# EAGLE design ESPixelGECE (EAGLE 7.4.0)
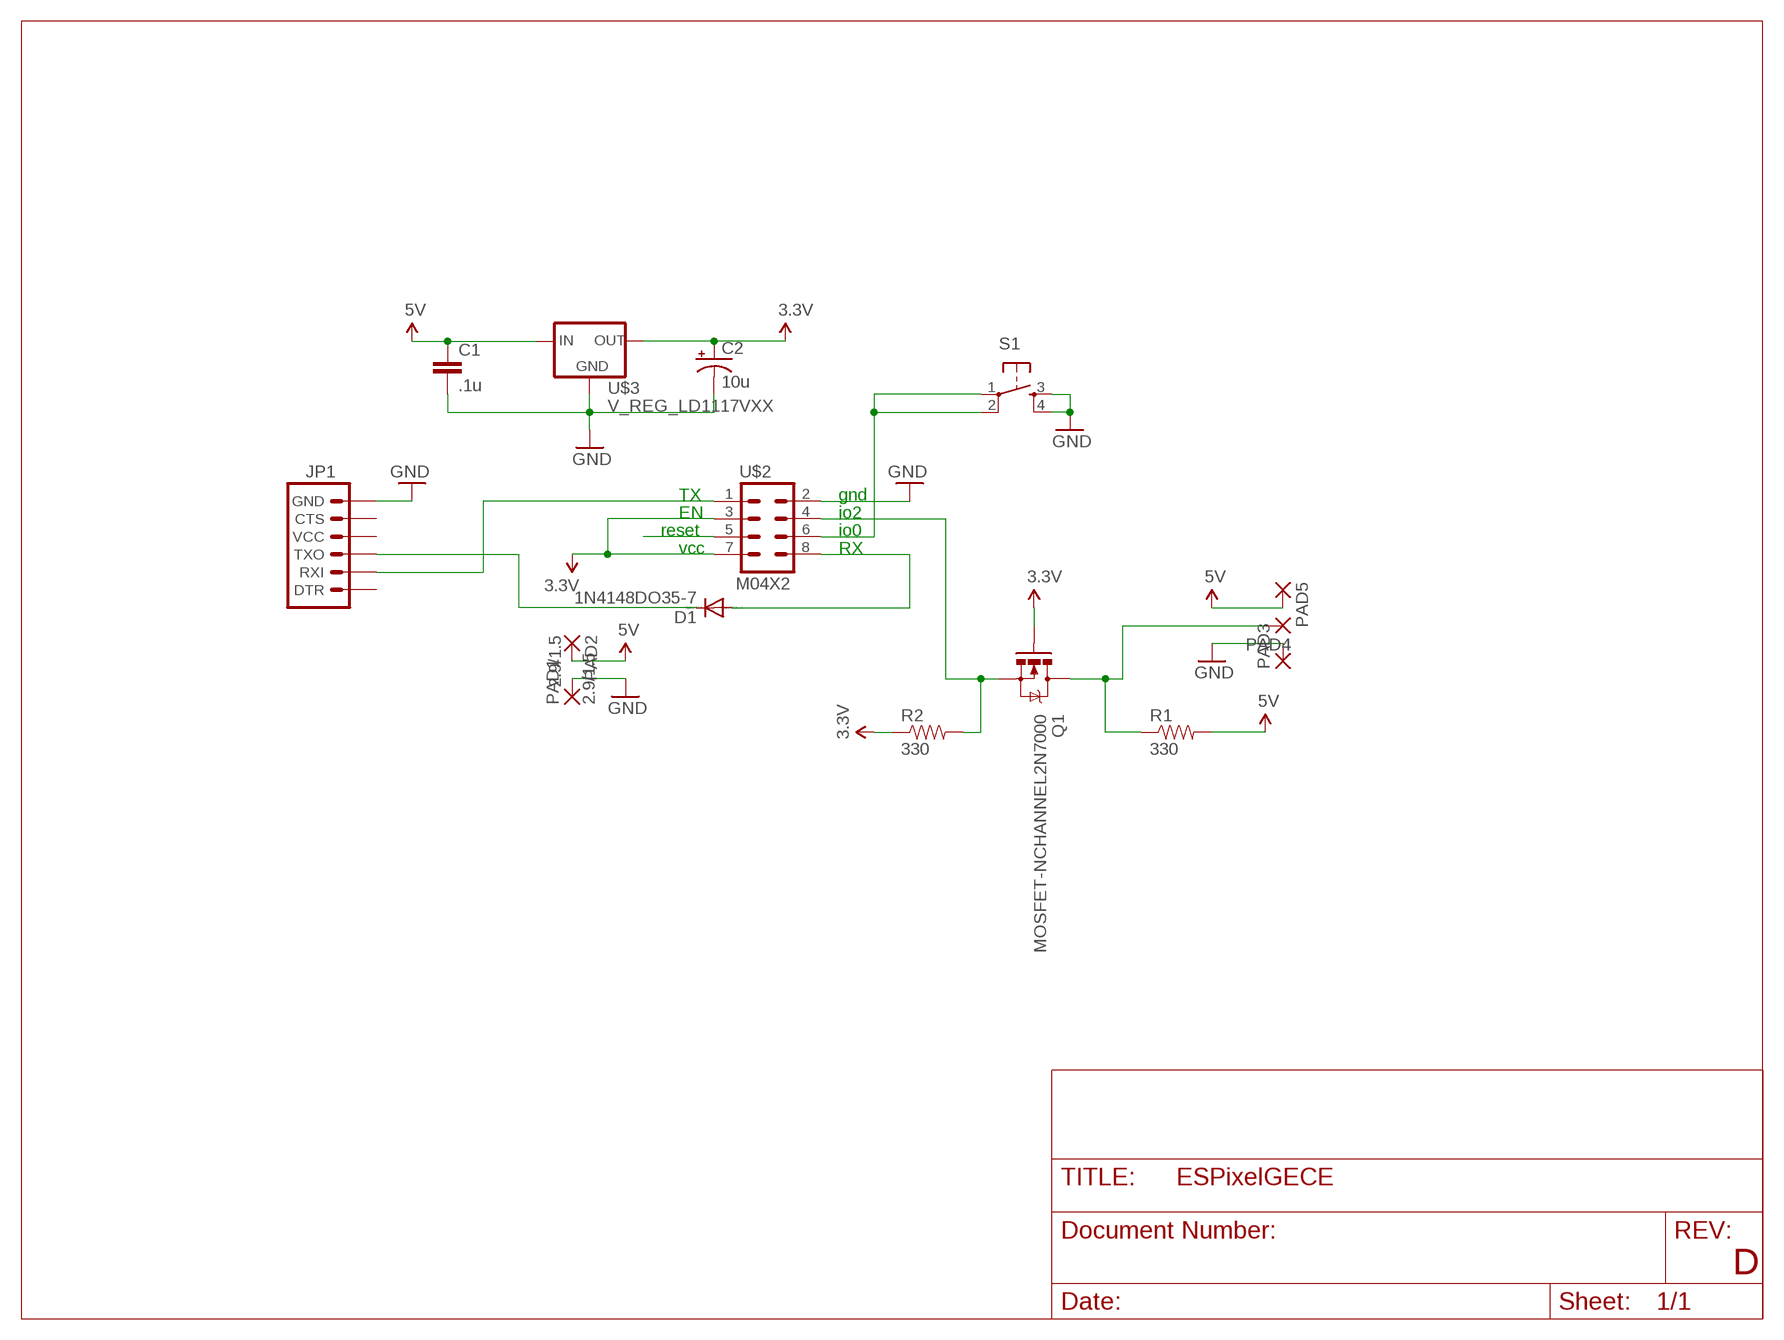
[diagram p0: schematic, sheet 1]

## Parts
C1  .1u  CAPEZ  [CAP-PTH-SMALLEZ]
C2  10u  CAP_POLPTH2  [CPOL-RADIAL-10UF-25V]
D1  1N4148DO35-7  [DO35-7]
JP1  ARDUINO_SERIAL_PROGRAMLOCK  [1X06_LOCK]
PAD1  2.9/1.5  [2.9/1.5]
PAD2  2.9/1.5  [2.9/1.5]
PAD3  2,15/1,0  [2,15/1,0]
PAD4  2,15/1,0  [2,15/1,0]
PAD5  2,15/1,0  [2,15/1,0]
Q1  MOSFET-NCHANNEL2N7000  [TO-92]
R1  330  RESISTOREZ  [AXIAL-0.3EZ]
R2  330  RESISTOREZ  [AXIAL-0.3EZ]
S1  TAC_SWITCHPTH  [TACTILE-PTH]
U$2  M04X2  [2X4]
U$3  V_REG_LD1117VXX  [78XXL]

## Nets
3.3V [PWR]: C2.1(+) Q1.2(G) R2.P$1 U$2.3 U$2.7 U$3.GND(OUT)
5V [PWR]: C1.1 PAD2.1(P) PAD5.1(P) R1.P$2 U$3.OUT(IN)
GND: C1.2 C2.2(-) JP1.6(GND) PAD1.1(P) PAD3.1(P) S1.3 S1.4 U$2.2 U$3.IN(GND)
N$1: JP1.2(RXI) U$2.1
N$2: D1.A U$2.8
N$3: U$2.5
N$4: PAD4.1(P) Q1.3(D) R1.P$1
N$5: S1.1 S1.2 U$2.6
N$6: Q1.1(S) R2.P$2 U$2.4
N$8: D1.C JP1.3(TXO)
Unconnected: JP1.1(DTR) JP1.4(VCC) JP1.5(CTS)

## Notes on the sheet
- TX | gnd
- EN | io2
- reset | io0
- vcc | RX
- D

## Library data of the parts
C1 = SparkFun-Capacitors:CAP: Capacitor Standard 0603 ceramic capacitor, and 0.1" leaded capacitor.
C2 = SparkFun-Capacitors:CAP_POL: Capacitor Polarized These are standard SMD and PTH capacitors. Normally 10uF, 47uF, and 100uF in electrolytic and tantalum varieties. Always verify the external diameter of the through hole cap, it varies with capacity, voltage, and manufacturer. The EIA devices should be standard.
D1 = diode:1N4148: DIODE high speed (Philips)
JP1 = SparkFun-Connectors:ARDUINO_SERIAL_PROGRAM: FTDI connector footprints
PAD1 PAD2 = wirepad:2.9/1.5
PAD3-PAD5 = wirepad:2,15/1,0: THROUGH-HOLE PAD
Q1 = SparkFun-DiscreteSemi:MOSFET-NCHANNEL: Common NMOSFET Parts MFG P/N Store ID Prod ID FDD8780 TRANS-09984 SI7820DN TRANS-11055 FDS6630A IC-08089 2N7002PW TRANS-11151 FQP30N06L COM-10213 TRANS-10060 BSS123LT1G TRANS-08345 BSS138 TRANS-00830 BS170 2N7000
R1 R2 = SparkFun-Resistors:RESISTOR: Resistor Basic schematic elements and footprints for 0603, 1206, and PTH resistors.
S1 = SparkFun-Retired:TAC_SWITCH: Momentary Switch Button commonly used for reset or general input. Spark Fun Electronics SKU : COM-00097 SMT- SWCH-08247
U$2 = SparkFun-Connectors:M04X2: .1" header, two rows of four.
U$3 = SparkFun-PowerIC:V_REG_LD1117VXX: LD1117VXX voltage regulator. We carry the 3.3V version (COM-00526) in TO-220 package.

## Net classes
0 default: width 0.305 mm
1 PWR: width 0.508 mm

## Board
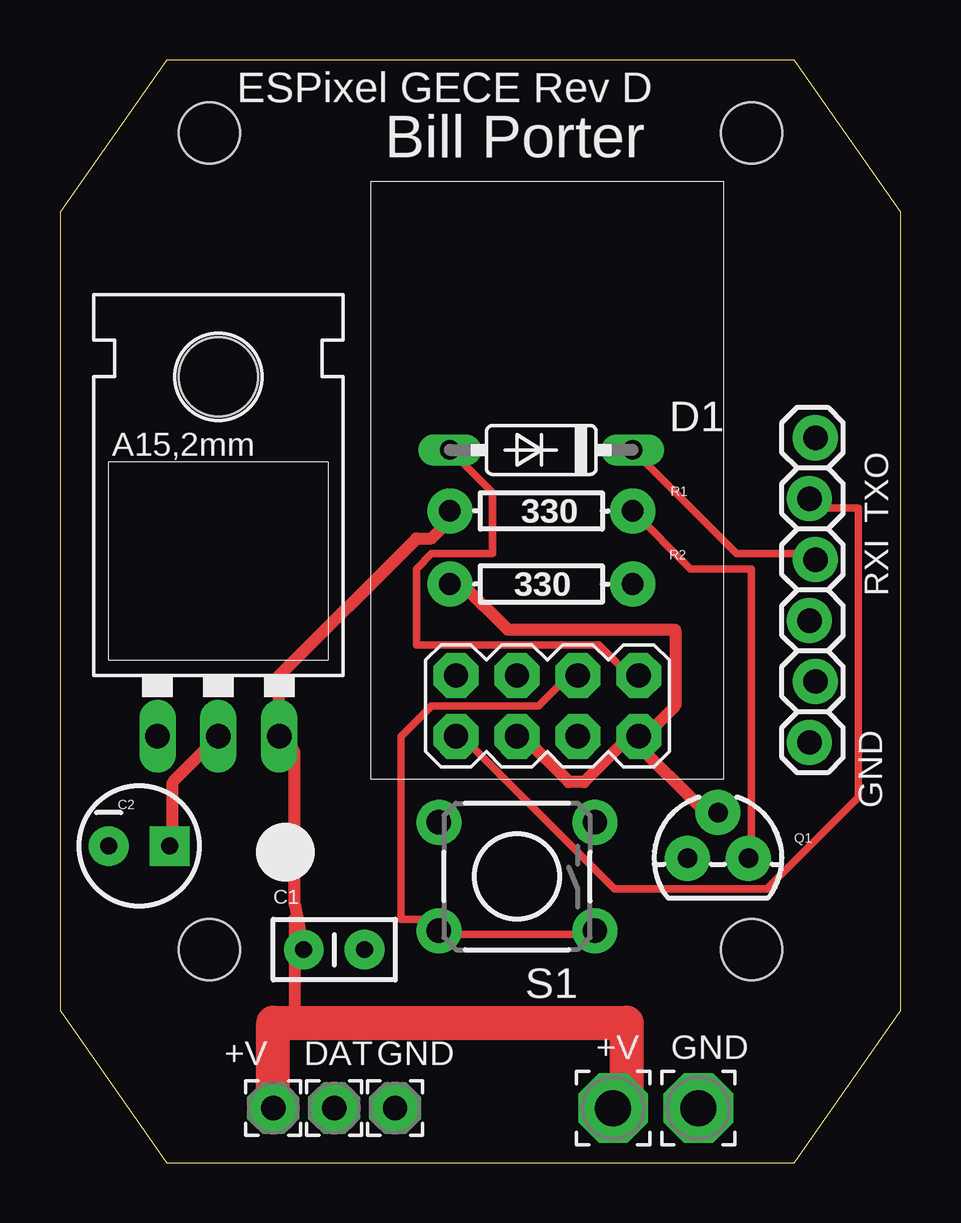
[diagram p1: board, top side]
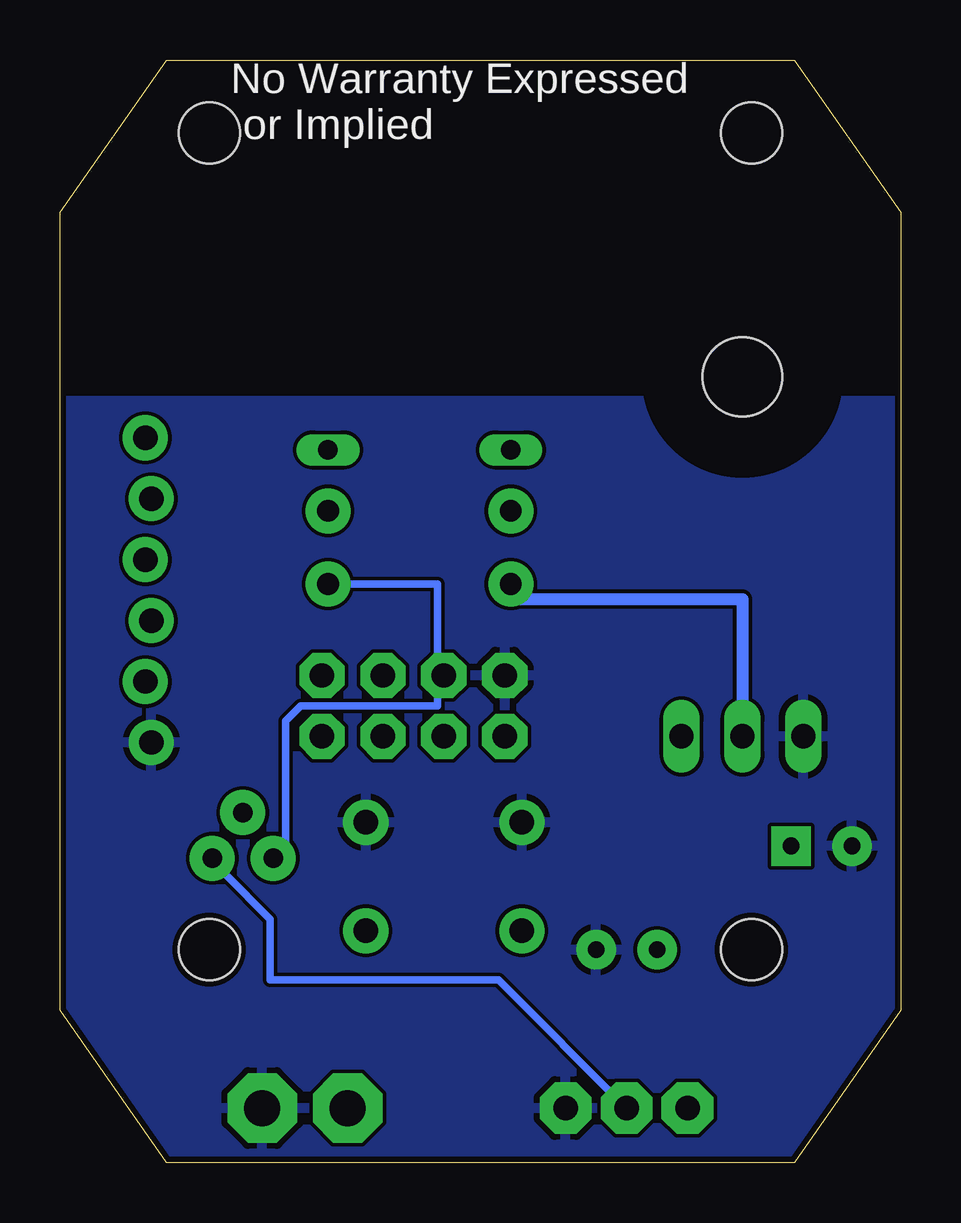
[diagram p2: board, bottom side, seen from below]

Size 35.05 x 45.97 mm. Coordinates in mm from the lower left corner, seen from the top.
Outline: 30.61,0 35.05,6.35 35.05,39.62 30.61,45.97 4.45,45.97 0,39.62 0,6.35 4.45,0 30.61,0
Copper layers (1*16): Top 0.035mm / dielectric 1.5mm / Bottom 0.035mm
Design rules "SeeedStudio_2layer_DRU_no_angle_20140221": minimum track width 6mil, minimum drill 12mil, track to track 6mil, track to pad 6mil, pad to pad 6mil, via to via 6mil, smd to smd 0mil, copper to edge 10mil, drill to drill 10mil, minimum pad ring 10mil, minimum via ring 6mil, stop-mask expansion 2mil, vias tented up to drill 100mil, thermal gap 10mil
Holes 2.54 mm at 6.22,42.93 28.83,42.93 6.22,8.89 28.83,8.89

### Footprints (pad centres in the part's own frame; a part is rotated, then mirrored left to right if it is on the bottom)
CAP-PTH-SMALLEZ = drill 0.7 pad 1.651: 1 0,0; 2 2.54,0
CPOL-RADIAL-10UF-25V = drill 0.7 pad 1.651 square: 1 1.27,0 | drill 0.7 pad 1.651: 2 -1.27,0
DO35-7 = drill 0.813 long: A 3.81,0; C -3.81,0
1X06_LOCK = drill 1.016 pad 1.88: 1 0,0; 2 2.54,-0.254; 3 5.08,0; 4 7.62,-0.254; 5 10.16,0; 6 12.7,-0.254
2.9/1.5 = drill 1.5 pad 2.9 octagon: 1 0.2,0
2,15/1,0 = drill 1.016 pad 2.159 octagon: 1 0,0
TO-92 = drill 0.813 pad 1.88: 1 -1.27,0; 2 0,1.905; 3 1.27,0
AXIAL-0.3EZ = drill 0.9 pad 1.88: P$1 -3.81,0; P$2 3.81,0
TACTILE-PTH = drill 1.016 pad 1.88: 1 -3.251,2.261; 2 3.251,2.261; 3 -3.251,-2.261; 4 3.251,-2.261
2X4 = drill 1.016 pad 1.88 octagon: 1 -3.81,-1.27; 2 -3.81,1.27; 3 -1.27,-1.27; 4 -1.27,1.27; 5 1.27,-1.27; 6 1.27,1.27; 7 3.81,-1.27; 8 3.81,1.27
78XXL = drill 1.016 long: GND 0,-3.81; IN -2.54,-3.81; OUT 2.54,-3.81 | hole 3.302: 0,11.176

### Placement (x,y rotation side)
C1  10.16,8.89 0 top
C2  3.3,13.21 0 top
D1  20.07,29.72 180 top
JP1  31.5,30.23 270 top
PAD1  26.42,2.29 0 top
PAD2  22.86,2.29 0 top
PAD3  13.97,2.29 0 top
PAD4  11.43,2.29 0 top
PAD5  8.89,2.29 0 top
Q1  27.43,12.7 0 top
R1  20.07,27.18 180 top
R2  20.07,24.13 0 top
S1  19.05,11.94 180 top
U$2  20.32,19.05 0 top
U$3  6.6,21.59 0 top

### Tracks (layer width: path | path; a pad name or v marks a point on that pad's centre or on a via)
3.3V
  Top 0.508: U$3.GND 4.7,15.88 4.7,13.34 C2.1 | 23.75,17.78 21.84,15.88 21.21,15.88 19.3,17.78 U$2.3 | 23.75,17.78 26.92,14.61 Q1.2 | 23.75,17.78 U$2.7 24.38,17.78 25.65,19.05 25.65,22.22 18.67,22.22 16.76,24.13 R2.P$1
  Bottom 0.508: U$3.GND 6.6,23.49 16.13,23.49 16.76,24.13 R2.P$1
5V
  Top 0.508: 23.62,2.54 23.11,2.54 PAD2.1 | 8.89,5.84 9.78,6.35 9.78,10.16 C1.1 9.78,10.79 9.78,17.14 U$3.OUT 9.14,20.32 14.86,26.03 15.49,26.03 16.13,26.67 R1.P$2
  Top 1.422: PAD5.1 8.89,5.84 23.62,5.84 23.62,2.54 23.62,2.03
GND
  pour Bottom: -2.54,31.75 37.85,31.75 37.34,-2.29 -2.29,-2.29
N$1
  Top 0.305: U$2.1 16.76,17.78 23.11,11.43 29.46,11.43 33.27,15.24 33.27,27.3 31.37,27.3 JP1.2
N$2
  Top 0.305: D1.A 18.03,27.94 18.03,25.4 15.49,25.4 14.86,24.77 14.86,21.59 22.48,21.59 23.75,20.32 U$2.8
N$4
  Top 0.305: R1.P$1 26.29,24.77 28.83,24.77 28.83,12.7 Q1.3
  Bottom 0.305: PAD4.1 16.76,7.62 26.29,7.62 26.29,10.16 28.19,12.06 28.19,12.7 Q1.3
N$5
  Top 0.305: S1.1 21.84,9.52 16.13,9.52 S1.2 15.49,10.16 14.22,10.16 14.22,17.78 15.49,19.05 19.94,19.05 21.21,20.32 U$2.6
N$6
  Bottom 0.305: 19.3,20.32 19.3,19.05 25.02,19.05 25.65,18.41 25.65,12.7 Q1.1 | R2.P$2 19.3,24.13 19.3,20.32 | 19.3,20.32 U$2.4
N$8
  Top 0.305: D1.C 28.19,25.4 31.37,25.4 JP1.3

### Text on the board
tNames: ESPixel GECE Rev D | Bill Porter | TXO | RXI | GND | GND | +V | DAT | GND | +V
bNames: No Warranty Expressed / or Implied